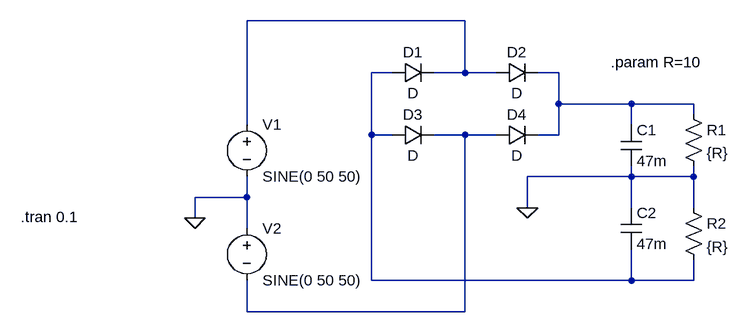
[diagram p0: schematic fuente.asc]
fuente.asc, the LTspice schematic file:
Version 4
SHEET 1 1148 680
WIRE 432 -32 96 -32
WIRE 320 48 288 48
WIRE 432 48 432 -32
WIRE 432 48 384 48
WIRE 480 48 432 48
WIRE 576 48 544 48
WIRE 576 96 576 48
WIRE 688 96 576 96
WIRE 784 96 688 96
WIRE 784 112 784 96
WIRE 96 128 96 -32
WIRE 688 128 688 96
WIRE 288 144 288 48
WIRE 320 144 288 144
WIRE 432 144 384 144
WIRE 480 144 432 144
WIRE 576 144 576 96
WIRE 576 144 544 144
WIRE 688 208 688 192
WIRE 688 208 528 208
WIRE 784 208 784 192
WIRE 784 208 688 208
WIRE 96 240 96 208
WIRE 96 240 16 240
WIRE 528 256 528 208
WIRE 688 256 688 208
WIRE 784 256 784 208
WIRE 16 272 16 240
WIRE 96 288 96 240
WIRE 288 368 288 144
WIRE 688 368 688 320
WIRE 688 368 288 368
WIRE 784 368 784 336
WIRE 784 368 688 368
WIRE 96 416 96 368
WIRE 432 416 432 144
WIRE 432 416 96 416
FLAG 16 272 0
FLAG 528 256 0
SYMBOL rui\\shortcuts\\voltage 96 112 R0
WINDOW 123 0 0 Left 2
WINDOW 39 0 0 Left 2
SYMATTR InstName V1
SYMATTR Value SINE(0 50 50)
SYMBOL diode 320 64 R270
WINDOW 0 32 32 VTop 2
WINDOW 3 0 32 VBottom 2
SYMATTR InstName D1
SYMBOL diode 480 64 R270
WINDOW 0 32 32 VTop 2
WINDOW 3 0 32 VBottom 2
SYMATTR InstName D2
SYMBOL diode 320 160 R270
WINDOW 0 32 32 VTop 2
WINDOW 3 0 32 VBottom 2
SYMATTR InstName D3
SYMBOL diode 480 160 R270
WINDOW 0 32 32 VTop 2
WINDOW 3 0 32 VBottom 2
SYMATTR InstName D4
SYMBOL res 768 96 R0
SYMATTR InstName R1
SYMATTR Value {R}
SYMBOL cap 672 128 R0
SYMATTR InstName C1
SYMATTR Value 47m
SYMBOL rui\\shortcuts\\voltage 96 272 R0
WINDOW 123 0 0 Left 2
WINDOW 39 0 0 Left 2
SYMATTR InstName V2
SYMATTR Value SINE(0 50 50)
SYMBOL res 768 240 R0
SYMATTR InstName R2
SYMATTR Value {R}
SYMBOL cap 672 256 R0
SYMATTR InstName C2
SYMATTR Value 47m
TEXT -252 270 Left 2 !.tran 0.1
TEXT 656 32 Left 2 !.param R=10

The netlist it stands for:
* fuente.asc
V1 N001 0 SINE(0 50 50)
D1 N002 N001 D
D2 N001 N003 D
D3 N002 N004 D
D4 N004 N003 D
R1 N003 0 {R}
C1 N003 0 47m
V2 0 N004 SINE(0 50 50)
R2 0 N002 {R}
C2 0 N002 47m
.model D D
.lib standard.dio
.tran 0.1
.param R=10
.backanno
.end